# EAGLE schematic Current_sense (EAGLE 8.5.1)

## Sheet 1 of 2: POWER
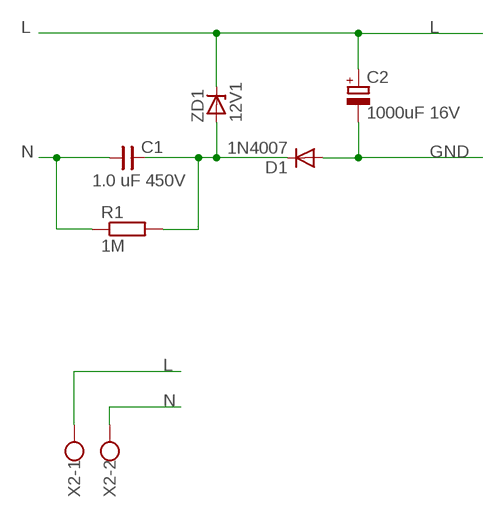
[diagram p0: schematic, sheet 1]

### Parts
C1  1.0 uF 450V  CNP-C150-190X070  [C150-190X070]
C2  1000uF 16V  CPOL-EUE5-8.5  [E5-8,5]
D1  1N4007  1N4004  [DO41-10]
R1  1M  R-EU_0207/10  [0207/10]
X2  W237-102  [W237-102]
ZD1  12V1  ZD-DO35Z10  [DO35Z10]

### Nets
GND: C2.- D1.A ; also sheet 2
L: C2.+ X2.1 ZD1.C ; also sheet 2
N: C1.1 R1.1 X2.2 ; also sheet 2
N$4: C1.2 D1.C R1.2 ZD1.A

## Sheet 2 of 2: OP-AMP
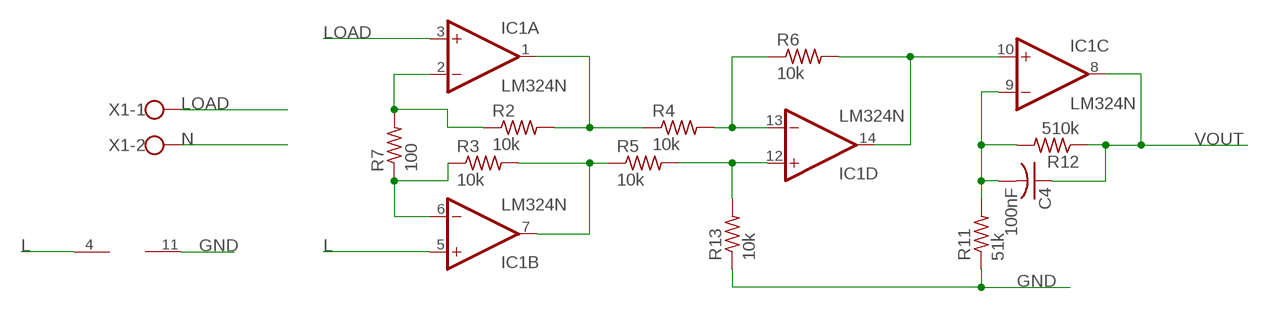
[diagram p1: schematic, sheet 2]

### Parts
C4  100nF  C-US050-035X075  [C050-035X075]
IC1  LM324N  [DIL14]
R2  10k  R-US_0207/10  [0207/10]
R3  10k  R-US_0207/10  [0207/10]
R4  10k  R-US_0207/10  [0207/10]
R5  10k  R-US_0207/10  [0207/10]
R6  10k  R-US_0207/10  [0207/10]
R7  100  R-US_0207/10  [0207/10]
R11  51k  R-US_0207/10  [0207/10]
R12  510k  R-US_0207/10  [0207/10]
R13  10k  R-US_0207/10  [0207/10]
X1  W237-103  [W237-103]

### Nets
GND: IC1.11(P:V-) R11.1 R13.1 ; also sheet 1
L: IC1.4(P:V+) IC1.5(B:+IN) ; also sheet 1
LOAD: IC1.3(A:+IN) X1.1
N: X1.2 ; also sheet 1
N$1: IC1.2(A:-IN) R2.1 R7.2
N$2: IC1.6(B:-IN) R3.1 R7.1
N$3: IC1.7(B:OUT) R3.2 R5.1
N$5: IC1.1(A:OUT) R2.2 R4.1
N$7: IC1.13(D:-IN) R4.2 R6.1
N$8: IC1.12(D:+IN) R5.2 R13.2
N$13: IC1.10(C:+IN) IC1.14(D:OUT) R6.2
N$14: C4.2 IC1.9(C:-IN) R11.2 R12.2
VOUT: C4.1 IC1.8(C:OUT) R12.1
Unconnected: X1.3

## Library data of the parts
C1 = cap-master:CNP-: NON-POLARIZED CAP
C2 = rcl:CPOL-EU: POLARIZED CAPACITOR, European symbol; SPICEPREFIX: C
C4 = rcl:C-US: CAPACITOR, American symbol; SPICEPREFIX: C
D1 = adafruit:1N4004: DIODE General purpose 1N400x type rectifier (With bigger pads) http://www.ladyada.net/library/pcb/eaglelibrary.html
IC1 = linear:LM324: OP AMP
R1 = rcl:R-EU_: RESISTOR, European symbol; SPICEPREFIX: R
R2-R7 R11-R13 = rcl:R-US_: RESISTOR, American symbol; SPICEPREFIX: R
X1 = con-wago-500:W237-103: WAGO SCREW CLAMP; MPN: 237-103; OC_FARNELL: unknown; OC_NEWARK: 18M7116
X2 = con-wago-500:W237-102: WAGO SCREW CLAMP
ZD1 = diodes:ZD-: Zener diode